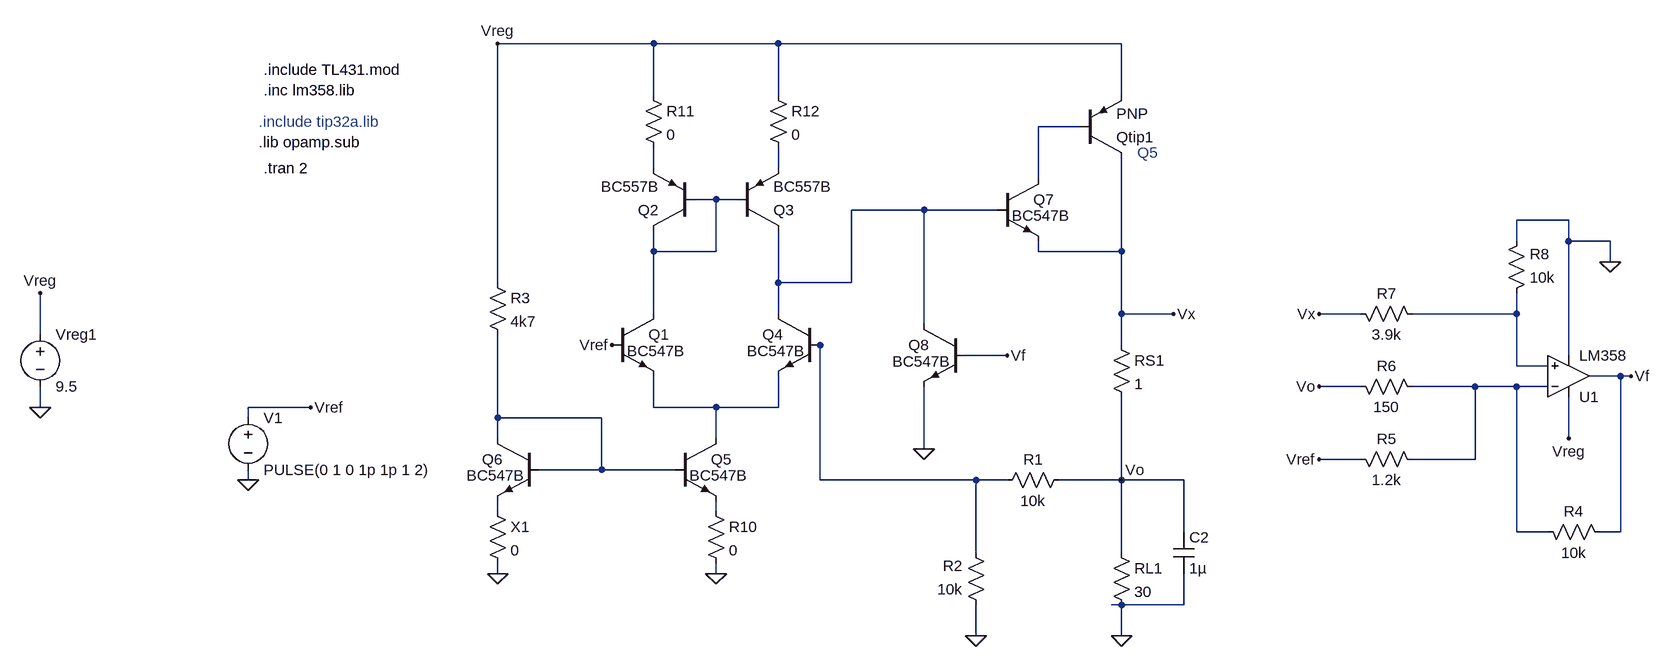
[diagram p0: schematic Draft1.asc]
Draft1.asc, the LTspice schematic file:
Version 4
SHEET 1 1352 680
WIRE -192 -368 -432 -368
WIRE 0 -368 -192 -368
WIRE 528 -368 0 -368
WIRE -192 -288 -192 -368
WIRE 0 -288 0 -368
WIRE 528 -288 528 -368
WIRE 464 -240 400 -240
WIRE -192 -176 -192 -208
WIRE 0 -176 0 -208
WIRE 400 -160 400 -240
WIRE -96 -128 -128 -128
WIRE -64 -128 -96 -128
WIRE 224 -112 112 -112
WIRE 336 -112 224 -112
WIRE 1216 -96 1136 -96
WIRE 1136 -64 1136 -96
WIRE 1216 -64 1216 -96
WIRE 1280 -64 1216 -64
WIRE -192 -48 -192 -80
WIRE -96 -48 -96 -128
WIRE -96 -48 -192 -48
WIRE 400 -48 400 -64
WIRE 528 -48 528 -192
WIRE 528 -48 400 -48
WIRE 1280 -32 1280 -64
WIRE -432 0 -432 -368
WIRE 0 0 0 -80
WIRE 112 0 112 -112
WIRE 112 0 0 0
WIRE -192 48 -192 -48
WIRE 0 48 0 0
WIRE 528 48 528 -48
WIRE 608 48 528 48
WIRE 896 48 832 48
WIRE 1136 48 1136 16
WIRE 1136 48 976 48
WIRE 224 64 224 -112
WIRE -1136 80 -1136 16
WIRE 64 96 48 96
WIRE 528 96 528 48
WIRE 352 112 288 112
WIRE 1216 112 1216 -64
WIRE 1136 128 1136 48
WIRE 1184 128 1136 128
WIRE 1296 144 1248 144
WIRE 1312 144 1296 144
WIRE 896 160 832 160
WIRE 1072 160 976 160
WIRE 1136 160 1072 160
WIRE 1184 160 1136 160
WIRE -1136 192 -1136 160
WIRE -720 192 -816 192
WIRE -192 192 -192 144
WIRE -96 192 -192 192
WIRE 0 192 0 144
WIRE 0 192 -96 192
WIRE -816 208 -816 192
WIRE -432 208 -432 80
WIRE -272 208 -432 208
WIRE -432 240 -432 208
WIRE -96 240 -96 192
WIRE 1216 240 1216 176
WIRE 224 256 224 160
WIRE 896 272 832 272
WIRE 1072 272 1072 160
WIRE 1072 272 976 272
WIRE -272 288 -272 208
WIRE -272 288 -368 288
WIRE -160 288 -272 288
WIRE -816 304 -816 288
WIRE 64 304 64 96
WIRE 304 304 64 304
WIRE 352 304 304 304
WIRE 528 304 528 176
WIRE 528 304 432 304
WIRE 624 304 528 304
WIRE -432 352 -432 336
WIRE -96 352 -96 336
WIRE 624 384 624 304
WIRE 1136 384 1136 160
WIRE 1184 384 1136 384
WIRE 1296 384 1296 144
WIRE 1296 384 1264 384
WIRE 304 416 304 304
WIRE 528 416 528 304
WIRE -432 448 -432 432
WIRE -96 448 -96 432
WIRE 528 496 512 496
WIRE 624 496 624 448
WIRE 624 496 528 496
WIRE 304 544 304 496
WIRE 528 544 528 496
FLAG -96 448 0
FLAG -432 448 0
FLAG 528 544 0
FLAG 304 544 0
FLAG -256 96 Vref
FLAG -1136 192 0
FLAG -1136 16 Vreg
FLAG -432 -368 Vreg
FLAG 528 304 Vo
FLAG 608 48 Vx
FLAG 224 256 0
FLAG 352 112 Vf
FLAG 1312 144 Vf
FLAG 832 272 Vref
FLAG 832 160 Vo
FLAG 832 48 Vx
FLAG 1216 240 Vreg
FLAG -816 304 0
FLAG -720 192 Vref
FLAG 1280 -32 0
SYMBOL npn -256 48 R0
WINDOW 3 23 57 Left 2
SYMATTR Value BC547B
SYMATTR InstName Q1
SYMBOL pnp -128 -80 R180
SYMATTR InstName Q2
SYMATTR Value BC557B
SYMBOL res 448 288 R90
WINDOW 0 0 56 VBottom 2
WINDOW 3 32 56 VTop 2
SYMATTR InstName R1
SYMATTR Value 10k
SYMBOL res 320 512 R180
WINDOW 0 36 76 Left 2
WINDOW 3 36 40 Left 2
SYMATTR InstName R2
SYMATTR Value 10k
SYMBOL res -448 -16 R0
SYMATTR InstName R3
SYMATTR Value 4k7
SYMBOL voltage -1136 64 R0
WINDOW 123 0 0 Left 0
WINDOW 39 0 0 Left 0
SYMATTR InstName Vreg1
SYMATTR Value 9.5
SYMBOL res 512 400 R0
SYMATTR InstName RL1
SYMATTR Value 30
SYMBOL pnp 464 -192 M180
SYMATTR InstName Qtip1
SYMBOL res 512 80 R0
SYMATTR InstName RS1
SYMATTR Value 1
SYMBOL res 1280 400 M270
WINDOW 0 32 56 VTop 2
WINDOW 3 0 56 VBottom 2
SYMATTR InstName R4
SYMATTR Value 10k
SYMBOL res 992 288 M270
WINDOW 0 32 56 VTop 2
WINDOW 3 0 56 VBottom 2
SYMATTR InstName R5
SYMATTR Value 1.2k
SYMBOL res 992 176 M270
WINDOW 0 32 56 VTop 2
WINDOW 3 0 56 VBottom 2
SYMATTR InstName R6
SYMATTR Value 150
SYMBOL res 992 64 M270
WINDOW 0 32 56 VTop 2
WINDOW 3 0 56 VBottom 2
SYMATTR InstName R7
SYMATTR Value 3.9k
SYMBOL res 1120 32 M180
WINDOW 0 36 76 Left 2
WINDOW 3 36 40 Left 2
SYMATTR InstName R8
SYMATTR Value 10k
SYMBOL OpAmps\\opamp2 1216 208 M180
SYMATTR InstName U1
SYMATTR Value LM358
SYMBOL pnp -64 -80 M180
SYMATTR InstName Q3
SYMATTR Value BC557B
SYMBOL npn 64 48 M0
WINDOW 3 23 57 Left 2
SYMATTR Value BC547B
SYMATTR InstName Q4
SYMBOL npn -160 240 R0
WINDOW 3 23 57 Left 2
SYMATTR Value BC547B
SYMATTR InstName Q5
SYMBOL npn -368 240 M0
WINDOW 3 23 57 Left 2
SYMATTR Value BC547B
SYMATTR InstName Q6
SYMBOL npn 336 -160 R0
WINDOW 3 23 57 Left 2
SYMATTR Value BC547B
SYMATTR InstName Q7
SYMBOL npn 288 64 M0
WINDOW 3 23 57 Left 2
SYMATTR Value BC547B
SYMATTR InstName Q8
SYMBOL res -112 336 R0
SYMATTR InstName R10
SYMATTR Value 0
SYMBOL res -448 336 R0
SYMATTR InstName X1
SYMATTR Value 0
SYMBOL res -208 -304 R0
SYMATTR InstName R11
SYMATTR Value 0
SYMBOL res -16 -304 R0
SYMATTR InstName R12
SYMATTR Value 0
SYMBOL cap 608 384 R0
SYMATTR InstName C2
SYMATTR Value 1µ
SYMBOL voltage -816 192 R0
WINDOW 123 0 0 Left 0
WINDOW 39 0 0 Left 0
SYMATTR InstName V1
SYMATTR Value PULSE(0 1 0 1p 1p 1 2)
TEXT -800 -248 Left 2 ;.include tip32a.lib
TEXT -800 -216 Left 2 !.lib opamp.sub
TEXT -792 -296 Left 2 !.inc lm358.lib
TEXT -792 -328 Left 2 !.include TL431.mod
TEXT 552 -200 Left 2 ;Q5
TEXT -792 -176 Left 2 !.tran 2

The netlist it stands for:
* Draft1.asc
Q1 N004 Vref N009 0 BC547B
Q2 N004 N004 N002 0 BC557B
R1 Vo N007 10k
R2 0 N007 10k
R3 Vreg N010 4k7
Vreg1 Vreg 0 9.5
RL1 Vo 0 30
Qtip1 Vx N001 Vreg 0 PNP
RS1 Vx Vo 1
R4 Vf N008 10k
R5 N008 Vref 1.2k
R6 N008 Vo 150
R7 N006 Vx 3.9k
R8 N006 0 10k
XU1 N006 N008 Vreg 0 Vf LM358  ; pins In+ In- V+ V- OUT
Q3 N005 N004 N003 0 BC557B
Q4 N005 N007 N009 0 BC547B
Q5 N009 N010 N012 0 BC547B
Q6 N010 N010 N011 0 BC547B
Q7 N001 N005 Vx 0 BC547B
Q8 N005 Vf 0 0 BC547B
R10 N012 0 0
R§X1 N011 0 0
R11 Vreg N002 0
R12 Vreg N003 0
C2 Vo 0 1µ
V1 Vref 0 PULSE(0 1 0 1p 1p 1 2)
.model NPN NPN
.model PNP PNP
.lib standard.bjt
* .include tip32a.lib
.lib opamp.sub
.inc lm358.lib
.include TL431.mod
* Q5
.tran 2
.backanno
.end